# EAGLE design optopair (EAGLE 7.5.0)
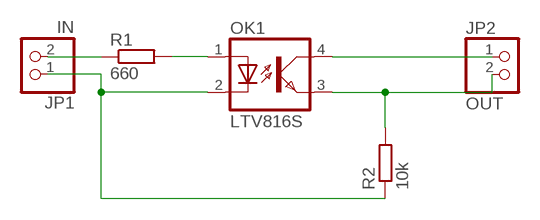
[diagram p0: schematic, sheet 1]

## Parts
JP1  IN  PINHD-1X2  [1X02]
JP2  OUT  PINHD-1X2  [1X02]
OK1  LTV816S  [SMD4]
R1  660  R-EU_R0805  [R0805]
R2  10k  R-EU_R0805  [R0805]

## Nets
N$1: JP1.2 R1.1
N$2: OK1.1(A) R1.2
N$3: JP1.1 OK1.2(C) R2.1
N$4: JP2.2 OK1.3(EMIT) R2.2
N$5: JP2.1 OK1.4(COL)

## Library data of the parts
JP1 JP2 = pinhead:PINHD-1X2: PIN HEADER
OK1 = optocoupler:LTV816: OPTO COUPLER Source: LITEON, LTV816.pdf; OC_FARNELL: unknown; OC_NEWARK: unknown
R1 R2 = resistor:R-EU_: RESISTOR, European symbol

## Board
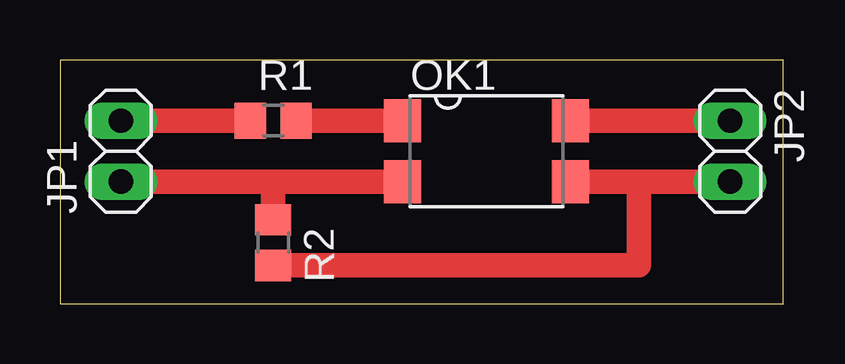
[diagram p1: board, top side]

Size 30.15 x 10.15 mm. Coordinates in mm from the lower left corner, seen from the top.
Outline: 0,0 30.15,0 30.15,10.15 0,10.15 0,0
Copper layers (1*16): Top 0.035mm / dielectric 1.5mm / Bottom 0.035mm
Design rules "default": minimum track width 10mil, minimum drill 24mil, track to track 8mil, track to pad 8mil, pad to pad 8mil, via to via 8mil, smd to smd 8mil, copper to edge 40mil, drill to drill 8mil, minimum pad ring 10mil, minimum via ring 8mil, stop-mask expansion 4mil, vias tented up to drill 0mil, thermal gap 10mil

### Footprints (pad centres in the part's own frame; a part is rotated, then mirrored left to right if it is on the bottom)
1X02 = drill 1.016 long: 1 -1.27,0; 2 1.27,0
SMD4 = smd 1.78 x 1.55: 1 -1.27,-3.5; 2 1.27,-3.5; 3 1.27,3.5; 4 -1.27,3.5
R0805 = smd 1.3 x 1.5: 1 -0.95,0; 2 0.95,0

### Placement (x,y rotation side)
JP1  2.54,6.35 90 top
JP2  27.94,6.35 270 top
OK1  17.78,6.35 270 top
R1  8.89,7.62 0 top
R2  8.89,2.54 270 top

### Tracks (layer width: path | path; a pad name or v marks a point on that pad's centre or on a via)
N$1
  Top 1.016: JP1.2 R1.1
N$2
  Top 1.016: R1.2 OK1.1
N$3
  Top 1.016: OK1.2 8.89,5.08 | 8.89,5.08 JP1.1 | R2.1 8.89,5.08
N$4
  Top 1.016: R2.2 24.13,1.59 24.13,5.08 | 24.13,5.08 OK1.3 | JP2.2 24.13,5.08
N$5
  Top 1.016: OK1.4 JP2.1